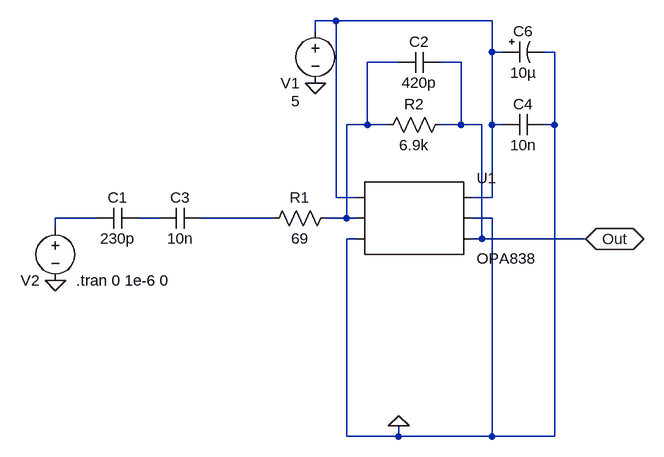
[diagram p0: schematic Draft3.asc]
Draft3.asc, the LTspice schematic file:
Version 4
SHEET 1 3444 1096
WIRE -736 16 -768 16
WIRE -496 16 -736 16
WIRE -768 32 -768 16
WIRE -496 64 -496 16
WIRE -480 64 -496 64
WIRE -400 64 -416 64
WIRE -640 80 -688 80
WIRE -544 80 -576 80
WIRE -688 176 -688 80
WIRE -688 176 -720 176
WIRE -656 176 -688 176
WIRE -544 176 -544 80
WIRE -544 176 -576 176
WIRE -512 176 -544 176
WIRE -496 176 -496 64
WIRE -480 176 -496 176
WIRE -400 176 -400 64
WIRE -400 176 -416 176
WIRE -736 288 -736 16
WIRE -704 288 -736 288
WIRE -496 288 -496 176
WIRE -496 288 -528 288
WIRE -1104 320 -1168 320
WIRE -1008 320 -1040 320
WIRE -832 320 -944 320
WIRE -720 320 -720 176
WIRE -720 320 -752 320
WIRE -704 320 -720 320
WIRE -496 320 -528 320
WIRE -1168 336 -1168 320
WIRE -704 352 -720 352
WIRE -512 352 -512 176
WIRE -512 352 -528 352
WIRE -352 352 -512 352
WIRE -720 656 -720 352
WIRE -640 656 -640 640
WIRE -640 656 -720 656
WIRE -496 656 -496 320
WIRE -496 656 -640 656
WIRE -400 656 -400 176
WIRE -400 656 -496 656
FLAG -768 112 0
FLAG -1168 416 0
FLAG -640 640 0
FLAG -352 352 Out
IOPIN -352 352 BiDir
SYMBOL res -736 304 R90
WINDOW 0 0 56 VBottom 2
WINDOW 3 32 56 VTop 2
SYMATTR InstName R1
SYMATTR Value 69
SYMBOL cap -1040 304 R90
WINDOW 0 0 32 VBottom 2
WINDOW 3 32 32 VTop 2
SYMATTR InstName C1
SYMATTR Value 230p
SYMBOL voltage -768 16 M0
WINDOW 0 24 96 Left 2
WINDOW 3 24 124 Left 2
WINDOW 123 0 0 Left 2
WINDOW 39 24 152 Left 2
SYMATTR InstName V1
SYMATTR Value 5
SYMBOL res -560 160 R90
WINDOW 0 0 56 VBottom 2
WINDOW 3 32 56 VTop 2
SYMATTR InstName R2
SYMATTR Value 6.9k
SYMBOL cap -576 64 R90
WINDOW 0 0 32 VBottom 2
WINDOW 3 32 32 VTop 2
SYMATTR InstName C2
SYMATTR Value 420p
SYMBOL voltage -1168 320 M0
WINDOW 0 24 96 Left 2
WINDOW 3 24 124 Invisible 2
WINDOW 123 24 152 Left 2
WINDOW 39 24 152 Left 2
SYMATTR InstName V2
SYMATTR Value PULSE(35 26.9 0 1e-9 300e-9 0 1e-6)
SYMBOL cap -944 304 R90
WINDOW 0 0 32 VBottom 2
WINDOW 3 32 32 VTop 2
SYMATTR InstName C3
SYMATTR Value 10n
SYMBOL cap -416 160 R90
WINDOW 0 0 32 VBottom 2
WINDOW 3 32 32 VTop 2
SYMATTR InstName C4
SYMATTR Value 10n
SYMBOL polcap -480 48 M90
WINDOW 0 0 32 VBottom 2
WINDOW 3 32 32 VTop 2
SYMATTR InstName C6
SYMATTR Value 10µ
SYMBOL AutoGenerated\\OPA838 -624 320 R0
SYMATTR InstName U1
SYMATTR ModelFile D:\SlugSat\GitHub\COVID-19-Simulations\SE\Radiation_Detector\Combined_Waveforms\pC ~ OPA855 ~ 20 ns\Parts\OPA838\OPA838.LIB
TEXT -1136 416 Left 2 !.tran 0 1e-6 0

The netlist it stands for:
* Draft3.asc
R1 N002 N005 69
C1 N004 N003 230p
V1 N001 0 5
R2 Out N002 6.9k
C2 Out N002 420p
V2 N003 0 PULSE(35 26.9 0 1e-9 300e-9 0 1e-6)
C3 N005 N004 10n
C4 0 N001 10n
C6 N001 0 10µ
* U1: OPA838 (symbol AutoGenerated\OPA838 not available, pins judged from their places): pin1=N001 pin2=N002 pin3=0 pin4=N001 pin5=0 pin6=Out
.tran 0 1e-6 0
.lib D:\SlugSat\GitHub\COVID-19-Simulations\SE\Radiation_Detector\Combined_Waveforms\pC ~ OPA855 ~ 20 ns\Parts\OPA838\OPA838.LIB
.backanno
.end